# Altium schematic sheet UV_Sheet1.SchDoc
size A; SheetNumber: 1; SheetTotal: 1
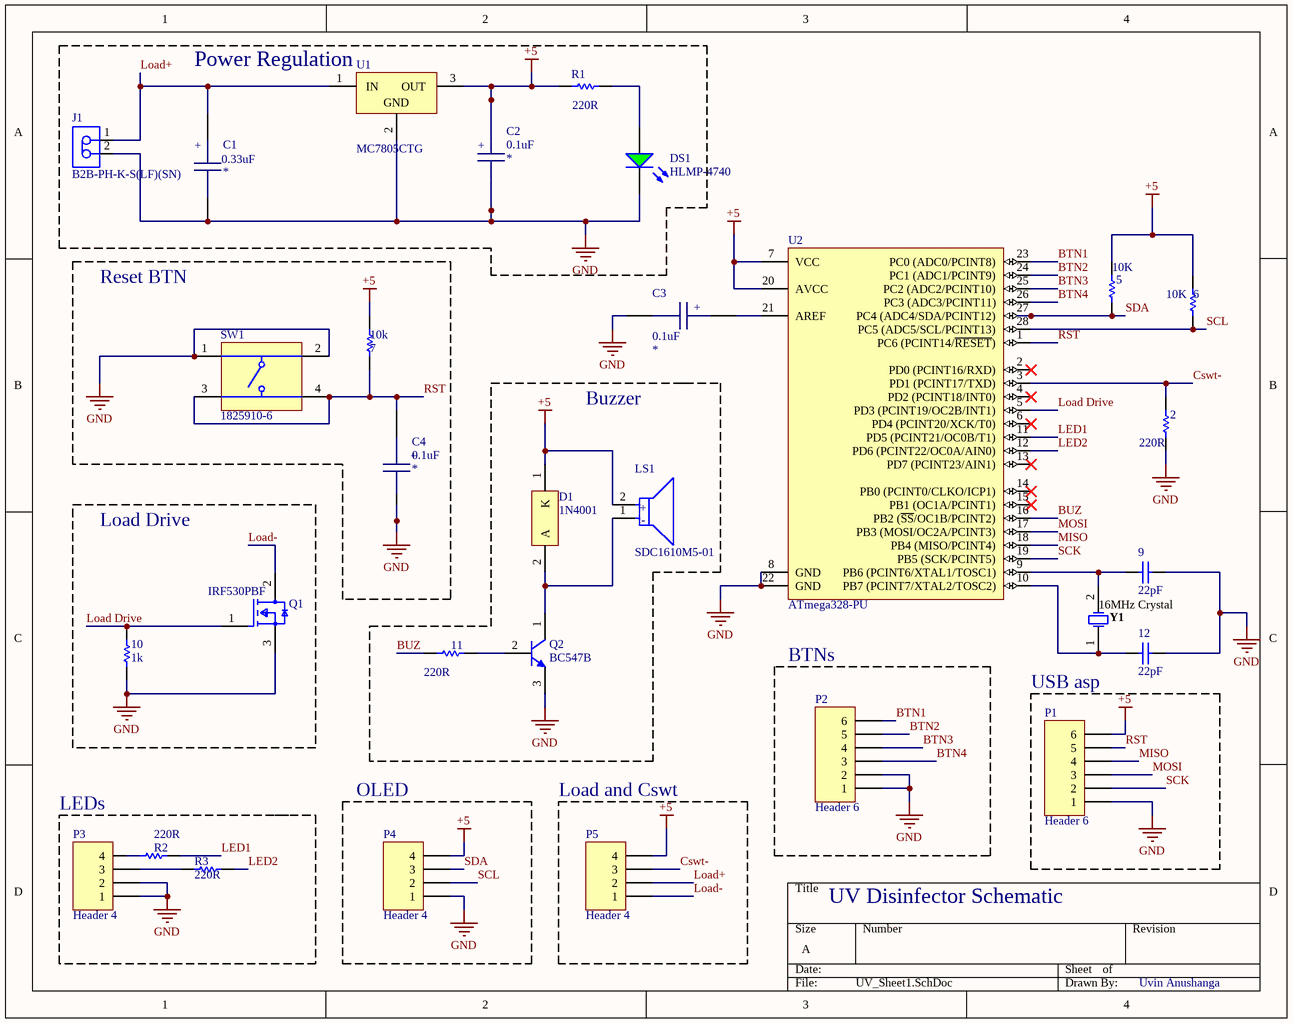
[diagram p0: UV_Sheet1.SchDoc]

## Parts
2  220R  [RESA60-630X240]
5  10K  [RESA60-630X240]
6  10K  [RESA60-630X240]
7  10k  [RESA60-630X240]
9  22pF  [KEMT-C315-THT-2]
10  1k  [RESA60-630X240]
11  220R  [RESA60-630X240]
12  22pF  [KEMT-C315-THT-2]
C1  0.33uF  [Cap NP]
C2  0.1uF  [Cap NP]
C3  0.1uF  [Cap NP]
C4  0.1uF  [Cap NP]
D1  1N4001  [ONSC-AXIAL_LEAD-2-59-10_P]
DS1  HLMP-4740  [AVAG-HLMP-4740]
J1  B2B-PH-K-S(LF)(SN)  [JST-B2B-PH-K-S_V]
LS1  SDC1610M5-01  [FP-SDC1610M5-01-MFG]
P1  Header 6  [HDR1X6]
P2  Header 6  [HDR1X6]
P3  Header 4  [HDR1X4]
P4  Header 4  [HDR1X4]
P5  Header 4  [HDR1X4]
Q1  IRF530PBF  [FP-X15-0364-MFG]
Q2  BC547B  [ONSC-TO-92-3-29-11]
R1  220R  [RESA60-630X240]
R2  220R  [RESA60-630X240]
R3  220R  [RESA60-630X240]
SW1  1825910-6  [TECO-1825910-6_V]
U1  MC7805CTG  [ONSC-TO-220-3-221AB-01]
U2  ATmega328-PU  [28P3]
Y1  16MHz Crystal  [FOX-FOXSLF080-20]

## Blocks framed on the sheet
Power Regulation: C1 C2 DS1 J1 R1 U1
Reset BTN: 7 C4 SW1
Buzzer: 11 D1 LS1 Q2
Load Drive: 10 Q1
BTNs: P2
USB asp: P1
LEDs: P3 R2 R3
OLED: P4
Load and Cswt: P5

## Nets
+5: 5.2 6.2 7.2 C2.2 D1.1(K) LS1.2(A) P1.6 P4.4 P5.4 R1.1 U1.3(OUT) U2.7(VCC) U2.20(AVCC)
GND: 2.1 9.2 10.1 12.2 C1.2 C2.1 C3.2 C4.1 DS1.2(K) J1.2 P1.1 P2.1 P2.2 P3.1 P3.2 P4.1 Q1.3(S) Q2.3(E) SW1.1 SW1.2 U1.2(GND) U2.8(GND) U2.22(GND)
BTN1: P2.6 U2.23(PC0_(ADC0/PCINT8))
BTN2: P2.5 U2.24(PC1_(ADC1/PCINT9))
BTN3: P2.4 U2.25(PC2_(ADC2/PCINT10))
BTN4: P2.3 U2.26(PC3_(ADC3/PCINT11))
BUZ: 11.1 U2.16(PB2_(~{SS}/OC1B/PCINT2))
Cswt-: 2.2 P5.3 U2.3(PD1_(PCINT17/TXD))
LED1: R2.2 U2.11(PD5_(PCINT21/OC0B/T1))
LED2: R3.2 U2.12(PD6_(PCINT22/OC0A/AIN0))
Load Drive: 10.2 Q1.1(G) U2.5(PD3_(PCINT19/OC2B/INT1))
Load+: C1.1 J1.1 P5.2 U1.1(IN)
Load-: P5.1 Q1.2(D)
MISO: P1.4 U2.18(PB4_(MISO/PCINT4))
MOSI: P1.3 U2.17(PB3_(MOSI/OC2A/PCINT3))
RST: 7.1 C4.2 P1.5 SW1.3 SW1.4 U2.1(PC6_(PCINT14/~{RESET}))
SCK: P1.2 U2.19(PB5_(SCK/PCINT5))
SCL: 6.1 P4.2 U2.28(PC5_(ADC5/SCL/PCINT13))
SDA: 5.1 P4.3 U2.27(PC4_(ADC4/SDA/PCINT12))
Net9_1: 9.1 U2.9(PB6_(PCINT6/XTAL1/TOSC1)) Y1.2
Net11_2: 11.2 Q2.2(B)
Net12_1: 12.1 U2.10(PB7_(PCINT7/XTAL2/TOSC2)) Y1.1
NetC3_1: C3.1 U2.21(AREF)
NetD1_2: D1.2(A) LS1.1(C) Q2.1(C)
NetDS1_1: DS1.1(A) R1.2
NetP3_3: P3.3 R3.1
NetP3_4: P3.4 R2.1

Not connected (* = marked no-connect by the designer): U2 2(PD0_(PCINT16/RXD))* 4(PD2_(PCINT18/INT0))* 6(PD4_(PCINT20/XCK/T0))* 13(PD7_(PCINT23/AIN1))* 14(PB0_(PCINT0/CLKO/ICP1))* 15(PB1_(OC1A/PCINT1))*

## Notes on the sheet
- (near C1) +
- (near C2) +
- (near C3) +
- (near C4) +
- UV Disinfector Schematic
- Uvin Anushanga
- (in symbol CMP-08413-000008-1) +; -

## Library data of the parts
2 5-7 10 11 R1-R3 = CMP-1659-00073-1: Axial Resistor, 100 KOhm, +/- 1%, 0.25 W, -55 to 155 degC, 2-Pin THD, RoHS, Bulk; Voltage Rating: 250 V; Power Rating: 250 mW; Resistance: 475 Ohm; PackageDescription: 2-Pin Axial Lead, Dia 2.4 mm, Body Length 6.3 mm; PackageReference: MFR-25; Length: 0.248 inch; ComponentLink2Description: Datasheet; Packaging: Bulk; DatasheetVersion: Apr-13; Package Quantity: 200; Min Operating Temperature: -55 degC; ComponentLink2URL: http://www.yageo.com/documents/recent/Yageo%20LR_MFR_2013.pdf; RoHSCompliant: true; ComponentLink1URL: http://www.yageo.com/; Tolerance: 1%; Case\Package: Axial; Mount: Through Hole; ComponentLink1Description: Manufacturer URL; Max Operating Temperature: 155 degC
9 12 = CMP-1664-00008-1: Capacitor, Ceramic, 22 pF, +/-10 %, 100 V, -55 to 125 degC, 2-Pin THD, RoHS, Bulk; Max Input Voltage: 40 V; Min Input Voltage: 4.2 V; Output Current: 1.5 A; Output Voltage: 1.2 V; Outputs: 1; Case\Package: TO-220; RoHSCompliant: true; Min Operating Temperature: 0 degC; Max Operating Temperature: 125 degC; Package Quantity: 50; ComponentLink2URL: http://capacitoredge.kemet.com/capedge2/DataSheet/Datasheet-C315C220K1G5TA.pdf?pn=C315C220K1G5TA{BULK}; Radiation Hardening: No; Pins: 3; Length: 10.28 mm; ComponentLink1URL: http://www.kemet.com/; ComponentLink2Description: Datasheet; Height: 9.28 mm; REACH SVHC: No SVHC; ComponentLink1Description: Manufacturer URL; Max Ouput Current: 1.5 A; Weight: 0.08113 oz; Packaging: Rail/Tube; DatasheetVersion: Aug-16; Mount: Through Hole; PackageReference: C315-THT-2; Width: 4.82 mm; PackageDescription: 2-Pin Through Hole Device, Body 3.81 x 2.54 mm
C1-C4 = Cap_NP: Value: *
D1 = CMP-0902-00117-1: Standard Recovery Rectifier, 2-Pin Axial_Lead, Pb-Free, Bulk Bag; Manufacturer: On Semiconductor; VRRM Max (V): 50; IFSM Max (A): 30; IO(rec) Max (A): 1; ComponentLink3URL: http://www.onsemi.cn/pub_link/Collateral/59-10.PDF; ComponentLink3Description: Package Specification; PartNumber: 1N4001; PackageVersion: Rev. U, 02/2005; Packing: Bulk Bag; ComponentLink2Description: Datasheet; RoHS: TRUE; DatasheetVersion: Rev. 13; PackageReference: AXIAL_LEAD-2-59-10; ComponentLink1URL: http://www.onsemi.com/; Mounting Technology: Through Hole; PackageDescription: 2-Pin, Axial Lead, Diameter 2.35 mm; ComponentLink2URL: http://www.onsemi.com/pub_link/Collateral/1N4001-D.PDF; Type: Standard Recovery; ComponentLink1Description: Manufacturer URL
DS1 = CMP-2000-06413-1: T-1 3/4 (5 mm) Low Current LED Lamp, Green, 1.9 V, -20 to 100 degC, 2-Pin THD, RoHS, Bulk; Manufacturer: AvagoTechnologies; Type: Uni-Color; Peak Wavelength: 565nm; Rad Hard: No; Viewing Angle: 50°; Dominant Wavelength/Color Temperature: 569nm; Number of LEDs: 1; Lens Appearance: ColoredDiffused; Lens Shape Type: Circular; Mounting Orientation: TopMount; Intensity: 2.3mcd; Datasheet Version: 07/2014; Category: LEDs; Datasheet URL: http://docs.avagotech.com/docs/AV02-1557EN; Packaging: Bulk; Pin Count: 2; Mounting Technology: ThroughHole; Package Reference: HLMP-4740; Mounting: ThroughHole; Manufacturer URL: http://www.avagotech.com/; Color: Green; Package: 2T-13/4; Package Description: 2-Pin Through Hole Device, Dia 5.845 mm, Pitch 2.54 mm
J1 = CMP-2000-05162-1: Male Header, Pitch 2 mm, 1 x 2 Position, Height 6 mm, Tail Length 3.4 mm, -25 to 85 degC, RoHS, Bulk; Manufacturer: JST; Pitch: 2mm; Style/Orientation: StraightHeader/Plug; No of Positions: 2; Datasheet Version: Nov-08; Datasheet URL: http://datasheet.octopart.com/B2B-PH-K-S%28LF%29%28SN%29-JST-datasheet-8324864.pdf; Manufacturer URL: http://www.jst.com/home2.html; Type: ShroudedHeader; Termination: Crimp
LS1 = CMP-08413-000008-1: AUDIO MAGNETIC INDICATOR 4-8V TH; Nominal Supply Voltage (DC): 5V; Input Type: DC; Max Supply Current: 30mA; Number of Terminals/Pins: 2; Frequency: 2.4kHz; Lead Free: Lead Free; Operating Supply Current: 30mA; Sensing Method: Magnetic; Termination: PC Pins; Number of Pins: 2; Mount: Through Hole; Min Operating Temperature: -10°C; Diameter: 16mm; Series: SDC; Max Operating Temperature: 70°C; Packaging: Tray; Voltage Rating: 5V; Height: 10mm
P1 P2 = Header 6: Header, 6-Pin; LatestRevisionDate: 17-Jul-2002; LatestRevisionNote: Re-released for DXP Platform.; Publisher: Altium Limited
P3-P5 = Header 4: Header, 4-Pin; LatestRevisionDate: 17-Jul-2002; LatestRevisionNote: Re-released for DXP Platform.; Publisher: Altium Limited
Q1 = CMP-02550-000190-1: MOSFET N-CH 100V 14A TO-220AB; Manufacturer: Vishay; Reverse Recovery Charge: 850nC; Rthja Max: 62°C/W; Power Dissipation: 88W; Depletion Mode: False; Input Capacitace At Vds: 670pF @ 25V; Pulse Drain Current: 56A; Turn On Delay Time: 10ns; Drain To Source Resistance: 0.16Ω; Number Of N Channels: 1; Max Junction Temp: +175°C; Threshold Vgs Max: 4V; Standoff Height: 3.33mm; Max Forward Diode Voltage: 2.5V; Turn Off Delay Time: 23ns; Gate To Source Voltage: 20V; Threshold Vgs Min: 2V; Reverse Recovery Time: 150ns; Gate Charge At Vgs: 26nC @ 10V; Temperature: -55°C to +175°C; Drain To Source Voltage: 100V; Mouser Description: MOSFET N-Chan 100V 14 Amp; Device Class L2: Transistors; Temperature Range High: +175°C; ComponentLink2URL: http://www.vishay.com/docs/91019/91019.pdf; Lead Free: Yes; Height: 19.89mm; Octopart: https://octopart.com/irf530pbf-vishay-46547999; Category: Trans; ComponentLink2Description: Datasheet; RoHS: TRUE; Device Class L3: MOSFETs; Automotive: No; Device Class L1: Discrete Semiconductors; Package: X15-0364; Manufacturer Part Number: IRF530PBF; Continuous Drain Current: 14A; Digikey Description: MOSFET N-CH 100V 14A TO-220AB; Number Of Channels: 1; Drain To Source Breakdown Voltage: 100V; Temperature Range Low: -55°C
Q2 = CMP-1048-01467-1: Amplifier Transistor, NPN Silicon, 3-Pin TO-92, Bulk Box; Manufacturer: On Semiconductor; IC Continuous (A): 0.1; fT Min (MHz): 150; DatasheetVersion: Rev. 7; ComponentLink1URL: http://www.onsemi.com/; Polarity: NPN; RoHS: FALSE; ComponentLink1Description: Manufacturer URL; Packing: Bulk Box; PackageDescription: 3-Pin Transistor Outline, Body 4.825 x 3.685 mm, Pitch 1.27 mm; ComponentLink3URL: http://www.onsemi.cn/pub_link/Collateral/2N6426-D.PDF; ComponentLink2Description: Datasheet; PackageVersion: Rev. AM; PackageReference: TO-92-3-29-11_AM_SL; ComponentLink3Description: Package Specification; Mounting Technology: Through Hole; PartNumber: BC547B; ComponentLink2URL: http://www.onsemi.com/pub_link/Collateral/BC546-D.PDF
SW1 = CMP-1684-00021-1: Tact Switch, SPST-NO, 0.05 A, -35 to 85 degC, 4-Pin THD, RoHS, Bulk; Manufacturer: TE Connectivity; Maximum Contact Resistance: 100mOhm; Mechanical Life: 100000Cycles; Bushing Type: Unthreaded; Switch Configuration: OFF(ON); Maximum DC Voltage Rating: 24V; Contact Rating @ Voltage: 0.05A@24VDC; Actuator Color: Black; Body Orientation: Straight; Function: MomentaryContact; Illumination: N/R; Actuator Style: RoundButton; Actuator Material: PolybutyleneTerephthalate; Dielectric Strength: 500VAC; Pole Throw Configuration: SPST; Actuator Length: 1.4mm; Product Weight: N/A; Contact Material: CopperAlloy; Housing Material: N/A; Terminal Type: PCPins; Minimum Insulation Resistance: 100MOhm; Package Description: 4-Pin Through Hole Device, Body 5.99 x 5.99 mm, Pitch 6.5 mm; Part No: 1825910-6; Package Reference: THD; Base Material: N/A; Manufacturer URL: http://www.te.com; Contact Plating: Silver; RoHS: Yes; Datasheet Version: Rev. C9; Electrical Life: 100000Cycles; Maximum AC Voltage Rating: N/A; Thread Size: N/R; Operating Temperature: -35to85C; Mounting: ThroughHole; Dimension: 5.99x5mm; Datasheet URL: http://www.te.com/commerce/DocumentDelivery/DDEController?Action=showdoc&DocId=Customer+Drawing%7F1825910%7FC9%7Fpdf%7FEnglish%7FENG_CD_1825910_C9.pdf%7F1825910-6; Family: 1825910; Seal Location: N/A; Seal Description: N/A; Packaging: N/A
U1 = CMP-2000-04928-1: Positive Voltage Regulator, 1 A, 5 V, 0 to 125 degC, 3-Pin TO-220, RoHS, Tube; Manufacturer: ON Semiconductor; Resistance, Thermal, Junction to Case: 5degC/W; Voltage, Supply: 35V; Regulator Function: Standard; Temperature, Operating, Maximum: +125degC; Load Regulation: 25mV; Regulator Type: PositiveVoltageOut; Current, Output, Maximum: 1A; Regulation, Load: 1.3mV; Number of Outputs: 1; Temperature, Operating, Range: 0to+125degC; Regulation, Line: 0.5mV; Line Regulation: 20mV; Voltage, Input Range: Maximumof35V; Output Type: Fixed; Current, Quiescent Supply: 6.5mA; Dropout Voltage: 2V; Temperature, Operating, Minimum: 0degC; Package Version: Rev. A, 11/2010; Current, Supply: 3.2mA; Voltage, Output: 5V; Voltage, Noise: 10μV/V; Package Type: TO-220; Voltage, Input, High Level: 35V; Datasheet URL: http://www.onsemi.com/pub_link/Collateral/MC7800-D.PDF; Dimensions: 10.28x4.82x15.75mm; Width: 4.82mm; Type: VoltageRegulator; Mounting Type: ThroughHole; Polarity: Positive; Datasheet Version: Rev. 27, 11/2014; Height: 15.75mm; Dropout Voltage Measurement Current: 1A; Package Description: 3-Pin Flange Mount, Vertical Straight Lead, Body 9.97 x 4.445 mm, Pitch 2.54 mm; Manufacturer URL: http://www.onsemi.com/; Voltage, Dropout: 2V; Length: 10.28mm; Number of Pins: 3; Package Reference: TO-220-3-221AB-01
U2 = CMP-0095-00015-2: 8-bit AVR Microcontroller, 32KB Flash, 1KB EEPROM, 2KB SRAM, 28-pin PDIP, Industrial Grade (-40°C to 85°C); ComponentLink3Description: ATmega48A/48PA/88A/88PA/168A/168PA/328/328P Summary; RevisionNote: DatasheetVersion updated. URLs added.; DatasheetVersion: revD, May-2011; ComponentLink1URL: http://www.atmel.com/; PackageVersion: revB, Sep-2001; PackageDescription: 28-lead (0.300"/7.62mm Wide) Plastic Dual Inline Package (PDIP); PackageReference: 28P3; ComponentLink1Description: Manufacturer URL; ComponentLink2Description: ATmega48A/48PA/88A/88PA/168A/168PA/328/328P Datasheet; ComponentLink3URL: http://www.atmel.com/dyn/resources/prod_documents/8271S.pdf; ComponentLink2URL: http://www.atmel.com/dyn/resources/prod_documents/8271.pdf
Y1 = CMP-003-00025-2: Resistance Weld Thru-Hole Crystal, 8 MHz, +/- 50 ppm, 10 pF, -20 to 70 degC, 2-Pin THD, RoHS, Bulk; Manufacturer: FOX Electronics; Load Capacitance: 20pF; Frequency Tolerance: 30ppm; Tolerance: 50ppm; ESR: 80; Resistance: 80Ohm; Frequency: 8MHz; Packaging: Bulk; Datasheet Version: Mar-15; Manufacturer URL: http://www.foxonline.com/; Package Reference: FOXSLF080-20; Max Operating Temperature: 70°C; Package Quantity: 100; RoHS Compliant: True; Pins: 2; Mounting Technology: TH; Package Description: 2-Pin Through Hole Device, Body 11.35 x 4.65 mm; Datasheet URL: http://download.siliconexpert.com/pdfs/2015/4/5/6/5/7/200/fox_/manual/35607121449963728hc49slf.pdf; Min Operating Temperature: -20°C; Case/Package: FOXSLF080-20